# EAGLE design Ionic_Skin_Sensorized_Glove (EAGLE 8.3.2)
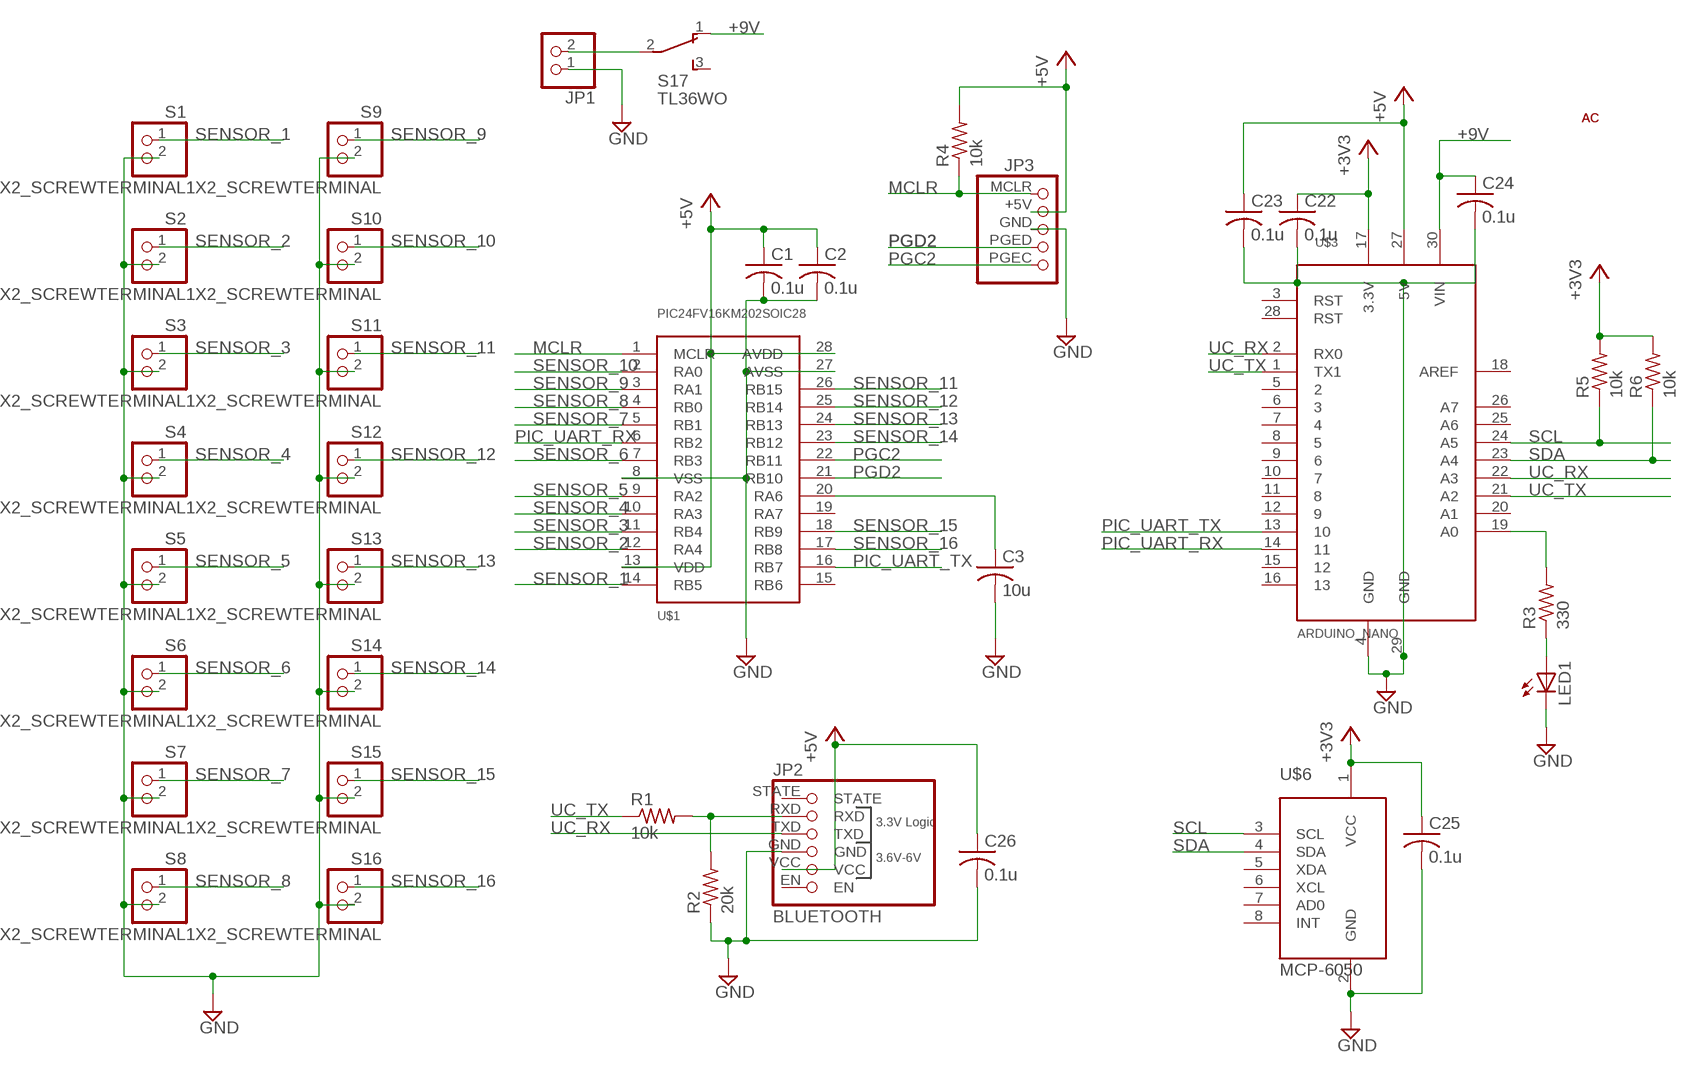
[diagram p0: schematic, sheet 1]

## Parts
C1  0.1u  C-USC0805  [C0805]
C2  0.1u  C-USC0805  [C0805]
C3  10u  C-USC0805  [C0805]
C22  0.1u  C-USC0805  [C0805]
C23  0.1u  C-USC0805  [C0805]
C24  0.1u  C-USC0805  [C0805]
C25  0.1u  C-USC0805  [C0805]
C26  0.1u  C-USC0805  [C0805]
JP1  PINHD-1X2  [1X02]
JP2  BLUETOOTH  HC-06  [HC-06]
JP3  PICKIT/90  [PICKIT/90]
LED1  LEDCHIPLED_0805  [CHIPLED_0805]
R1  10k  R-US_R0805  [R0805]
R2  20k  R-US_R0805  [R0805]
R3  330  R-US_R0805  [R0805]
R4  10k  R-US_R0805  [R0805]
R5  10k  R-US_R0805  [R0805]
R6  10k  R-US_R0805  [R0805]
S1  1X2_SCREWTERMINAL  [1X2-2.54MM]
S2  1X2_SCREWTERMINAL  [1X2-2.54MM]
S3  1X2_SCREWTERMINAL  [1X2-2.54MM]
S4  1X2_SCREWTERMINAL  [1X2-2.54MM]
S5  1X2_SCREWTERMINAL  [1X2-2.54MM]
S6  1X2_SCREWTERMINAL  [1X2-2.54MM]
S7  1X2_SCREWTERMINAL  [1X2-2.54MM]
S8  1X2_SCREWTERMINAL  [1X2-2.54MM]
S9  1X2_SCREWTERMINAL  [1X2-2.54MM]
S10  1X2_SCREWTERMINAL  [1X2-2.54MM]
S11  1X2_SCREWTERMINAL  [1X2-2.54MM]
S12  1X2_SCREWTERMINAL  [1X2-2.54MM]
S13  1X2_SCREWTERMINAL  [1X2-2.54MM]
S14  1X2_SCREWTERMINAL  [1X2-2.54MM]
S15  1X2_SCREWTERMINAL  [1X2-2.54MM]
S16  1X2_SCREWTERMINAL  [1X2-2.54MM]
S17  TL36WO  [TL3XWO]
U$1  PIC24FV16KM202SOIC28  [SOIC28]
U$3  ARDUINO_NANO  [ARDUINO_NANO]
U$6  MCP-6050  [MCP-6050_BREAKOUT]
U$7  AC_TOP  [AC_TOP]
U$8  AC_BOTTOM  [AC_BOTTOM]

## Nets
+3V3: C22.1 C25.1 R5.2 R6.2 U$3.17(3.3V) U$6.1(VCC)
+5V: C1.1 C2.1 C23.1 C26.1 JP2.VCC JP3.+5V R4.2 U$1.13(VDD) U$1.28(AVDD) U$3.27(5V)
+9V: C24.1 S17.1(O) U$3.30(VIN)
GND: C1.2 C2.2 C3.2 C22.2 C23.2 C24.2 C25.2 C26.2 JP1.1 JP2.GND JP3.GND LED1.C R2.1 S1.2 S2.2 S3.2 S4.2 S5.2 S6.2 S7.2 S8.2 S9.2 S10.2 S11.2 S12.2 S13.2 S14.2 S15.2 S16.2 U$1.8(VSS) U$1.27(AVSS) U$3.4(GND) U$3.29(GND) U$6.2(GND)
MCLR: JP3.MCLR R4.1 U$1.1(MCLR)
N$1: C3.1 U$1.20(RA6)
N$2: JP1.2 S17.2(P)
N$9: LED1.A R3.1
N$10: R3.2 U$3.19(A0)
N$76: JP2.RXD R1.2 R2.2
PGC2: JP3.PGEC U$1.22(RB11)
PGD2: JP3.PGED U$1.21(RB10)
PIC_UART_RX: U$1.6(RB2) U$3.14
PIC_UART_TX: U$1.16(RB7) U$3.13
SCL: R5.1 U$3.24(A5) U$6.3(SCL)
SDA: R6.1 U$3.23(A4) U$6.4(SDA)
SENSOR_1: S1.1 U$1.14(RB5)
SENSOR_2: S2.1 U$1.12(RA4)
SENSOR_3: S3.1 U$1.11(RB4)
SENSOR_4: S4.1 U$1.10(RA3)
SENSOR_5: S5.1 U$1.9(RA2)
SENSOR_6: S6.1 U$1.7(RB3)
SENSOR_7: S7.1 U$1.5(RB1)
SENSOR_8: S8.1 U$1.4(RB0)
SENSOR_9: S9.1 U$1.3(RA1)
SENSOR_10: S10.1 U$1.2(RA0)
SENSOR_11: S11.1 U$1.26(RB15)
SENSOR_12: S12.1 U$1.25(RB14)
SENSOR_13: S13.1 U$1.24(RB13)
SENSOR_14: S14.1 U$1.23(RB12)
SENSOR_15: S15.1 U$1.18(RB9)
SENSOR_16: S16.1 U$1.17(RB8)
UC_RX: JP2.TXD U$3.2(RX0) U$3.22(A3)
UC_TX: R1.1 U$3.1(TX1) U$3.21(A2)
Unconnected: JP2.EN JP2.STATE S17.3(S) U$1.15(RB6) U$1.19(RA7) U$3.3(RST) U$3.5 U$3.6 U$3.7 U$3.8 U$3.9 U$3.10 U$3.11 U$3.12 U$3.15 U$3.16 U$3.18(AREF) U$3.20(A1) U$3.25(A6) U$3.26(A7) U$3.28(RST) U$6.5(XDA) U$6.6(XCL) U$6.7(AD0) U$6.8(INT)

## Library data of the parts
C1-C3 C22-C26 = rcl:C-US: CAPACITOR, American symbol
JP1 = pinhead:PINHD-1X2: PIN HEADER
JP2 = BreakoutBoards:HC-06: PIN HEADER
JP3 = AC_Microchip:PICKIT: PIN HEADER
LED1 = adafruit:LED: LED OSRAM: - CHIPLED LG R971, LG N971, LY N971, LG Q971, LY Q971, LO R971, LY R971 LH N974, LH R974 LS Q976, LO Q976, LY Q976 LO Q996 - Hyper CHIPLED LW Q18S LB Q993, LB Q99A, LB R99A - SideLED LS A670, LO A670, LY A670, LG A670, LP A670 LB A673, LV A673, LT A673, LW A673 LH A674 LY A675 LS A676, LA A676, LO A676, LY A676, LW A676 LS A679, LY A679, LG A679 - Hyper Micro SIDELED® LS Y876, LA Y876, LO Y876, LY Y876 LT Y87S - SmartLED LW L88C, LW L88S LB L89C, LB L89S, LG L890 LS L89K, LO L89K, LY L89K LS L896, LA L896, LO L896, LY L896 - TOPLED LS T670, LO T670, LY T670, LG T670, LP T670 LSG T670, LSP T670, LSY T670, LOP T670, LYG T670 LG T671, LOG T671, LSG T671 LB T673, LV T673, LT T673, LW T673 LH T674 LS T676, LA T676, LO T676, LY T676, LB T676, LH T676, LSB T676, LW T676 LB T67C, LV T67C, LT T67C, LS T67K, LO T67K, LY T67K, LW E67C LS E67B, LA E67B, LO E67B, LY E67B, LB E67C, LV E67C, LT E67C LW T67C LS T679, LY T679, LG T679 LS T770, LO T770, LY T770, LG T770, LP T770 LB T773, LV T773, LT T773, LW T773 LH T774 LS E675, LA E675, LY E675, LS T675 LS T776, LA T776, LO T776, LY T776, LB T776 LHGB T686 LT T68C, LB T68C - Hyper Mini TOPLED® LB M676 - Mini TOPLED Santana® LG M470 LS M47K, LO M47K, LY M47K Source: http://www.osram.convergy.de/
R1-R6 = rcl:R-US_: RESISTOR, American symbol
S1-S16 = Connectors:1X2_SCREWTERMINAL: 3.5mm Terminal block http://www.ladyada.net/library/pcb/eaglelibrary.html
S17 = switch:TL36WO: TINY SWITCH ON - ON Source: http://www2.produktinfo.conrad.com/datenblaetter/700000-724999/705152-da-01-de-Subminiaturschalter_TL_36WO.pdf
U$1 = AC_Microchip:PIC24FV16KM202
U$3 = Arduino:ARDUINO_NANO
U$6 = BreakoutBoards:MCP-6050
U$7 = ANDREW_CUSTOM:AC_TOP
U$8 = ANDREW_CUSTOM:AC_BOTTOM

## Net classes
0 default: clearance 0.279 mm

## Board
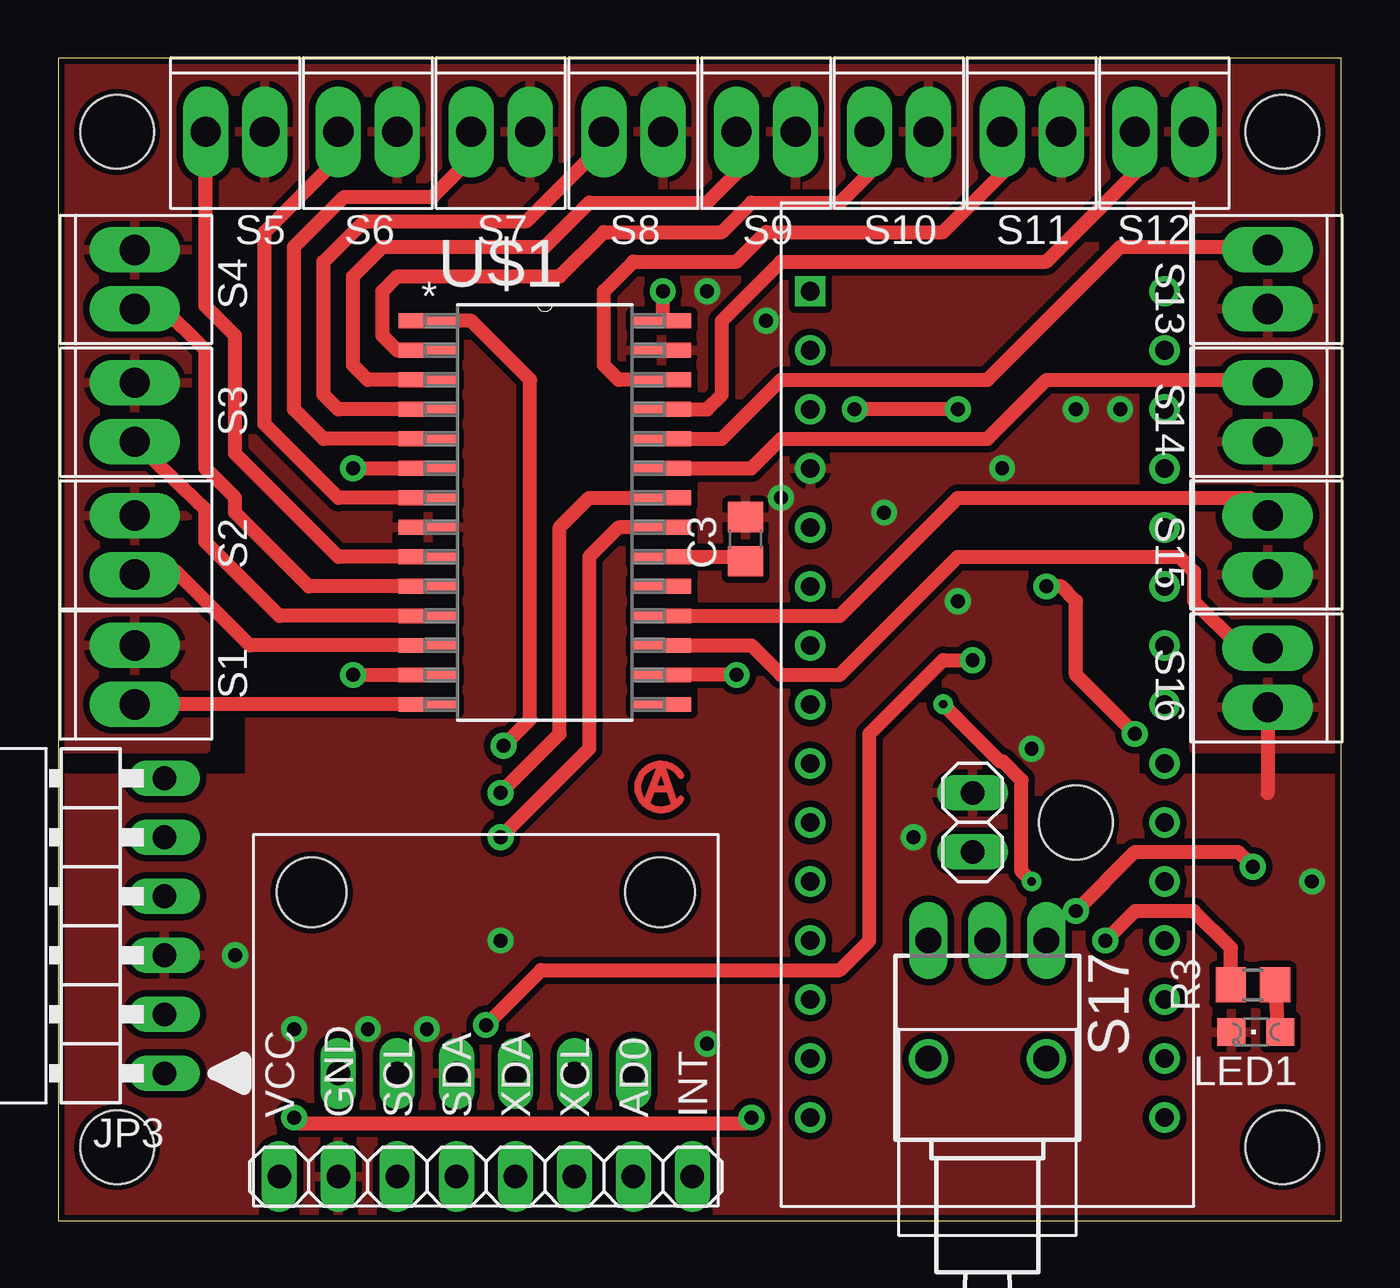
[diagram p1: board, top side]
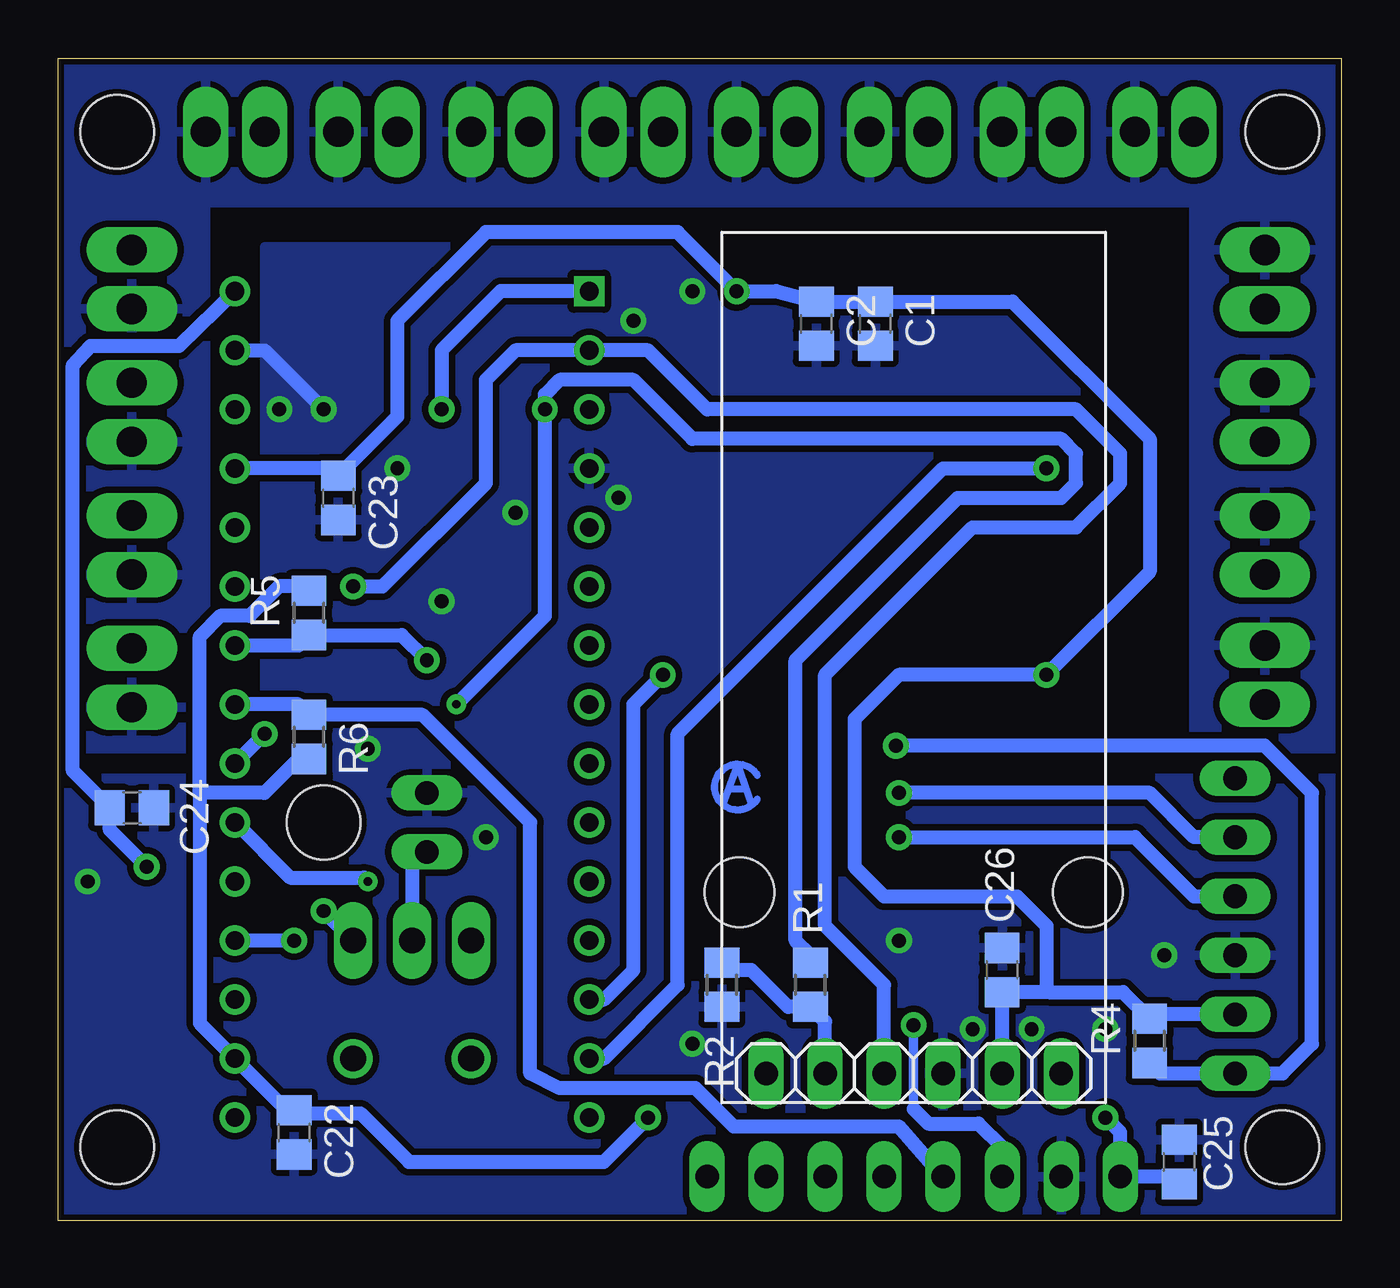
[diagram p2: board, bottom side, seen from below]

Size 55.24 x 50.04 mm. Coordinates in mm from the lower left corner, seen from the top.
Outline: 0,0 55.24,0 55.24,50.04 0,50.04 0,0
Copper layers (1*16): Top 0.035mm / dielectric 1.5mm / Bottom 0.035mm
Design rules "Nomad *": minimum track width 9mil, minimum drill 12mil, track to track 10mil, track to pad 10mil, pad to pad 10mil, via to via 10mil, smd to smd 0mil, copper to edge 10mil, drill to drill 5mil, minimum pad ring 10mil, minimum via ring 10mil, stop-mask expansion 1mil, vias tented up to drill 30mil, thermal gap 10mil
Holes 3.17 mm at 52.7,46.86 2.54,46.86 2.54,3.17 52.7,3.17 43.81,17.14

### Footprints (pad centres in the part's own frame; a part is rotated, then mirrored left to right if it is on the bottom)
C0805 = smd 1.3 x 1.5: 1 -0.95,0; 2 0.95,0
1X02 = drill 1.016 long: 1 -1.27,0; 2 1.27,0
HC-06 = drill 1.016 long: EN 13.97,1.27; GND 8.89,1.27; RXD 3.81,1.27; STATE 1.27,1.27; TXD 6.35,1.27; VCC 11.43,1.27
PICKIT/90 = drill 1.016 long: +5V -3.81,-3.81; GND -1.27,-3.81; MCLR -6.35,-3.81; NC 6.35,-3.81; PGEC 3.81,-3.81; PGED 1.27,-3.81
CHIPLED_0805 = smd 1.2 x 1.2: A 0,-1.05; C 0,1.05
R0805 = smd 1.3 x 1.5: 1 -0.95,0; 2 0.95,0
1X2-2.54MM = drill 1.3 long: 1 -1.27,0; 2 1.27,0
TL3XWO = drill 1.1 pad 1.422 long: 1 -2.54,-5.08; 2 0,-5.08; 3 2.54,-5.08 | drill 1.1 pad 1.676: M1 -2.54,0; M2 2.54,0
SOIC28 = smd 2.54 x 0.635: 1 -5.029,8.255; 2 -5.029,6.985; 3 -5.029,5.715; 4 -5.029,4.445; 5 -5.029,3.175; 6 -5.029,1.905; 7 -5.029,0.635; 8 -5.029,-0.635; 9 -5.029,-1.905; 10 -5.029,-3.175; 11 -5.029,-4.445; 12 -5.029,-5.715; 13 -5.029,-6.985; 14 -5.029,-8.255; 15 5.029,-8.255; 16 5.029,-6.985; 17 5.029,-5.715; 18 5.029,-4.445; 19 5.029,-3.175; 20 5.029,-1.905; 21 5.029,-0.635; 22 5.029,0.635; 23 5.029,1.905; 24 5.029,3.175; 25 5.029,4.445; 26 5.029,5.715; 27 5.029,6.985; 28 5.029,8.255
ARDUINO_NANO = drill 0.8 square: 1 1.27,39.37 | drill 0.8: 2 1.27,36.83; 3 1.27,34.29; 4 1.27,31.75; 5 1.27,29.21; 6 1.27,26.67; 7 1.27,24.13; 8 1.27,21.59; 9 1.27,19.05; 10 1.27,16.51; 11 1.27,13.97; 12 1.27,11.43; 13 1.27,8.89; 14 1.27,6.35; 15 1.27,3.81; 16 16.51,3.81; 17 16.51,6.35; 18 16.51,8.89; 19 16.51,11.43; 20 16.51,13.97; 21 16.51,16.51; 22 16.51,19.05; 23 16.51,21.59; 24 16.51,24.13; 25 16.51,26.67; 26 16.51,29.21; 27 16.51,31.75; 28 16.51,34.29; 29 16.51,36.83; 30 16.51,39.37
MCP-6050_BREAKOUT = drill 1.016 long: 1 1.27,8.89; 2 1.27,6.35; 3 1.27,3.81; 4 1.27,1.27; 5 1.27,-1.27; 6 1.27,-3.81; 7 1.27,-6.35; 8 1.27,-8.89 | hole 3: 13.5,7.5; 13.5,-7.5

### Placement (x,y rotation side)
C1  20.07,38.61 270 bottom
C2  22.61,38.61 270 bottom
C3  29.59,29.34 90 top
C22  45.09,3.81 270 bottom
C23  43.18,31.11 270 bottom
C24  52.07,17.78 0 bottom
C25  6.99,2.54 90 bottom
C26  14.61,10.79 90 bottom
JP1  39.37,17.14 270 top
JP2  26.04,5.08 0 bottom
JP3  0.76,12.7 90 top
LED1  51.56,8.13 90 top
R1  22.86,10.16 270 bottom
R2  26.67,10.16 90 bottom
R3  51.44,10.16 180 top
R4  8.26,7.75 90 bottom
R5  44.45,26.16 90 bottom
R6  44.45,20.83 270 bottom
S1  3.3,23.5 90 top
S2  3.3,29.08 90 top
S3  3.3,34.8 90 top
S4  3.3,40.51 90 top
S5  7.62,46.86 0 top
S6  13.34,46.86 0 top
S7  19.05,46.86 0 top
S8  24.77,46.86 0 top
S9  30.48,46.86 0 top
S10  36.2,46.86 0 top
S11  41.91,46.86 0 top
S12  47.62,46.86 0 top
S13  52.07,40.51 270 top
S14  52.07,34.8 270 top
S15  52.07,29.08 270 top
S16  52.07,23.37 270 top
S17  40.01,6.99 180 top
U$1  20.95,30.48 0 top
U$3  31.11,0.64 0 top
U$6  18.41,0.64 90 top
U$7  25.53,17.65 0 top
U$8  25.15,17.65 0 top

### Tracks (layer width: path | path; a pad name or v marks a point on that pad's centre or on a via)
+3V3  (via drill 0.6)
  Top 0.61: v29.84,4.45 29.59,4.19 10.41,4.19 v10.16,4.45
  Bottom 0.61: v29.84,4.45 31.75,2.54 40.14,2.54 42.23,4.63 44.95,4.63 C22.1 45.4,4.76 U$3.17 49.15,8.51 49.15,18.41 | v10.16,4.45 9.53,3.81 U$6.1 7.3,1.91 C25.1 | R5.2 44.64,27.3 45.72,27.3 46.99,26.04 48.26,26.04 49.15,25.15 49.15,18.41 | R6.2 44.89,19.88 46.35,18.41 49.14,18.41 49.15,18.41
+5V  (via drill 0.6)
  Top 0.61: U$1.28 26.04,38.73 v26.04,40.01 | v12.7,23.5 U$1.13
  Bottom 0.61: JP3.+5V 8.06,8.89 R4.2 9.4,9.85 12.6,9.85 | JP2.VCC C26.1 12.6,9.85 | 12.6,9.85 12.7,9.95 12.7,12.7 13.97,13.97 19.68,13.97 20.95,15.24 20.95,21.59 19.05,23.5 v12.7,23.5 8.26,27.94 8.26,33.66 14.16,39.56 C1.1 C2.1 24.32,40.01 v26.04,40.01 28.57,42.55 36.83,42.55 40.64,38.73 40.64,34.6 C23.1 43.5,32.38 U$3.27
+9V  (via drill 0.6)
  Top 0.61: v43.81,13.34 46.35,15.88 50.8,15.88 v51.44,15.24
  Bottom 0.61: U$3.30 50.04,37.66 53.85,37.66 54.61,36.83 54.61,19.37 C24.1 53.02,16.82 v51.44,15.24 | S17.1 v43.81,13.34
GND  (via drill 0.6)
  Top 0.61: S16.2 52.07,18.41
  Bottom 0.61: U$3.29 46.35,37.47 v43.81,34.92
  other vias: 53.98,14.61 41.91,20.32 40.64,32.38 36.83,16.51 38.73,26.67 35.56,30.48 45.72,34.92 10.16,8.26 13.34,8.26 15.88,8.26 19.05,12.06 7.62,11.43 27.94,40.01 30.48,38.73 31.11,31.11 27.94,7.62
  pour Bottom: 0,20.32 6.35,20.32 6.35,43.81 48.9,43.81 48.9,20.32 55.24,20.32 55.24,50.16 0,50.16
  pour Top: 0,20.32 6.35,20.32 6.35,43.81 48.9,43.81 48.9,20.32 55.24,20.32 55.24,50.16 0,50.16
  pour Bottom: 0,19.05 8.26,19.05 8.26,41.91 46.35,41.91 46.35,19.05 55.24,19.05 55.24,0 0,0
  pour Top: 8.26,19.05 8.26,41.91 46.35,41.91 46.35,19.05 55.24,19.05 55.24,0 0,0 0,19.05
MCLR  (via drill 0.6)
  Top 0.61: v19.18,20.45 20.32,21.59 20.32,36.2 17.78,38.73 U$1.1
  Bottom 0.61: R4.1 7.81,6.35 JP3.MCLR 2.54,6.35 1.27,7.62 1.27,18.41 3.3,20.45 v19.18,20.45
N$1
  Top 0.61: U$1.20 29.59,28.57 C3.1
N$2
  Bottom 0.61: JP1.2 40.01,15.24 S17.2
N$9
  Top 0.61: R3.1 52.51,8.23 LED1.A
N$10  (via drill 0.6)
  Top 0.61: R3.2 50.48,11.74 48.9,13.34 46.35,13.34 v45.09,12.06
  Bottom 0.61: v45.09,12.06 U$3.19
N$76
  Bottom 0.61: JP2.RXD 22.23,8.57 R1.2 23.82,9.21 25.4,10.79 26.36,10.79 R2.2
PGC2  (via drill 0.6)
  Top 0.61: v19.05,18.41 21.59,20.95 21.59,29.84 22.86,31.11 U$1.22
  Bottom 0.61: JP3.PGEC 6.35,16.51 8.26,18.41 v19.05,18.41
PGD2  (via drill 0.6)
  Top 0.61: U$1.21 24.13,29.84 22.86,28.57 22.86,20.32 v19.05,16.51
  Bottom 0.61: v19.05,16.51 8.89,16.51 6.35,13.97 JP3.PGED
PIC_UART_RX  (via drill 0.6)
  Top 0.61: v12.7,32.38 U$1.6
  Bottom 0.61: U$3.14 31.75,6.99 28.57,10.16 28.57,20.95 17.14,32.38 v12.7,32.38
PIC_UART_TX  (via drill 0.6)
  Top 0.61: v29.21,23.5 U$1.16
  Bottom 0.61: U$3.13 31.75,9.53 30.48,10.79 30.48,22.23 v29.21,23.5
SCL  (via drill 0.6)
  Top 0.61: v18.41,8.43 20.78,10.79 33.66,10.79 34.92,12.06 34.92,20.95 38.1,24.13 v39.37,24.13
  Bottom 0.406: 18.41,4.83 v18.41,8.43
  Bottom 0.61: 18.41,4.83 17.78,4.19 15.62,4.19 14.61,3.17 U$6.3 | v39.37,24.13 40.45,25.21 R5.1 44.9,24.77 U$3.24
SDA
  Bottom 0.61: U$6.4 19.05,4.06 26.16,4.06 27.81,5.71 33.66,5.71 34.92,6.35 34.92,17.14 39.56,21.78 R6.1 44.9,22.23 U$3.23
SENSOR_1
  Top 0.61: U$1.14 S1.1
SENSOR_2
  Top 0.61: U$1.12 8.26,24.77 5.08,27.94 3.43,27.94 S2.1
SENSOR_3
  Top 0.61: U$1.11 9.53,26.04 6.35,29.21 6.35,30.61 S3.1
SENSOR_4
  Top 0.61: U$1.10 10.79,27.3 7.62,30.48 7.62,31.11 6.35,32.38 6.35,37.47 4.45,39.37 3.43,39.37 S4.1
SENSOR_5
  Top 0.61: U$1.9 12.06,28.57 7.62,33.02 7.62,38.1 6.35,39.37 S5.1
SENSOR_6
  Top 0.61: U$1.7 12.06,31.11 8.89,34.29 8.89,42.55 12.06,45.72 S6.1
SENSOR_7
  Top 0.61: U$1.5 11.43,33.66 10.16,34.92 10.16,41.91 12.32,44.07 16.13,44.07 17.78,45.72 S7.1
SENSOR_8
  Top 0.61: U$1.4 12.06,34.92 11.43,35.56 11.43,41.27 13.18,43.03 20.17,43.03 23.5,46.35 S8.1
SENSOR_9
  Top 0.61: U$1.3 13.34,36.2 12.7,36.83 12.7,40.64 13.97,41.91 20.95,41.91 22.86,43.81 27.94,43.81 29.21,45.09 S9.1
SENSOR_10
  Top 0.61: U$1.2 14.61,37.47 13.97,38.1 13.97,40.01 14.61,40.64 21.59,40.64 23.5,42.55 28.57,42.55 29.84,43.81 33.66,43.81 34.92,45.09 S10.1
SENSOR_11
  Top 0.61: U$1.26 24.13,36.2 23.5,36.83 23.5,40.01 24.77,41.27 29.21,41.27 30.48,42.55 38.1,42.55 40.64,45.09 S11.1
SENSOR_12
  Top 0.61: U$1.25 27.94,34.92 28.57,35.56 28.57,38.73 31.11,41.27 42.55,41.27 46.35,45.09 S12.1
SENSOR_13
  Top 0.61: U$1.24 28.57,33.66 31.11,36.2 40.01,36.2 45.72,41.91 51.94,41.91 S13.1
SENSOR_14
  Top 0.61: U$1.23 29.84,32.38 31.11,33.66 40.01,33.66 42.55,36.2 51.94,36.2 S14.1
SENSOR_15
  Top 0.61: U$1.18 33.66,26.04 38.73,31.11 51.31,31.11 S15.1
SENSOR_16
  Top 0.61: U$1.17 29.84,24.77 31.11,23.5 33.66,23.5 38.73,28.57 48.26,28.57 48.9,27.94 48.9,26.67 50.8,24.77 51.94,24.77 S16.1
UC_RX  (via drill 0.6)
  Top 0.61: v46.35,20.95 43.81,23.5 43.81,26.67 43.18,27.3 v42.55,27.3
  Bottom 0.61: U$3.22 v46.35,20.95 | v42.55,27.3 41.27,27.3 36.83,31.75 36.83,36.2 35.56,37.47 U$3.2 29.84,37.47 27.3,34.92 11.43,34.92 9.53,33.02 9.53,31.75 11.43,29.84 15.88,29.84 22.23,23.5 22.23,12.7 21.87,12.34 19.68,10.16 JP2.TXD
UC_TX  (via drill 0.35, 0.6)
  Top 0.61: v41.91,14.61 41.48,15.04 41.48,18.97 40.69,19.76 40.56,19.76 v38.1,22.23 | v38.73,34.92 v34.29,34.92
  Bottom 0.61: 33.02,40.01 U$3.1 36.2,40.01 38.73,37.47 v38.73,34.92 | U$3.21 45.26,14.78 42.08,14.78 v41.91,14.61 | v38.1,22.23 34.29,26.04 v34.29,34.92 34.29,35.56 33.66,36.2 30.48,36.2 27.94,33.66 12.06,33.66 11.43,33.02 11.43,31.75 12.06,31.11 16.51,31.11 23.5,24.13 23.5,12.06 22.86,11.43 R1.1

### Text on the board
tDocu: +9V | GND | TX | RX | GND | +5V